# EAGLE schematic opengarden_v1 (EAGLE 6.1)
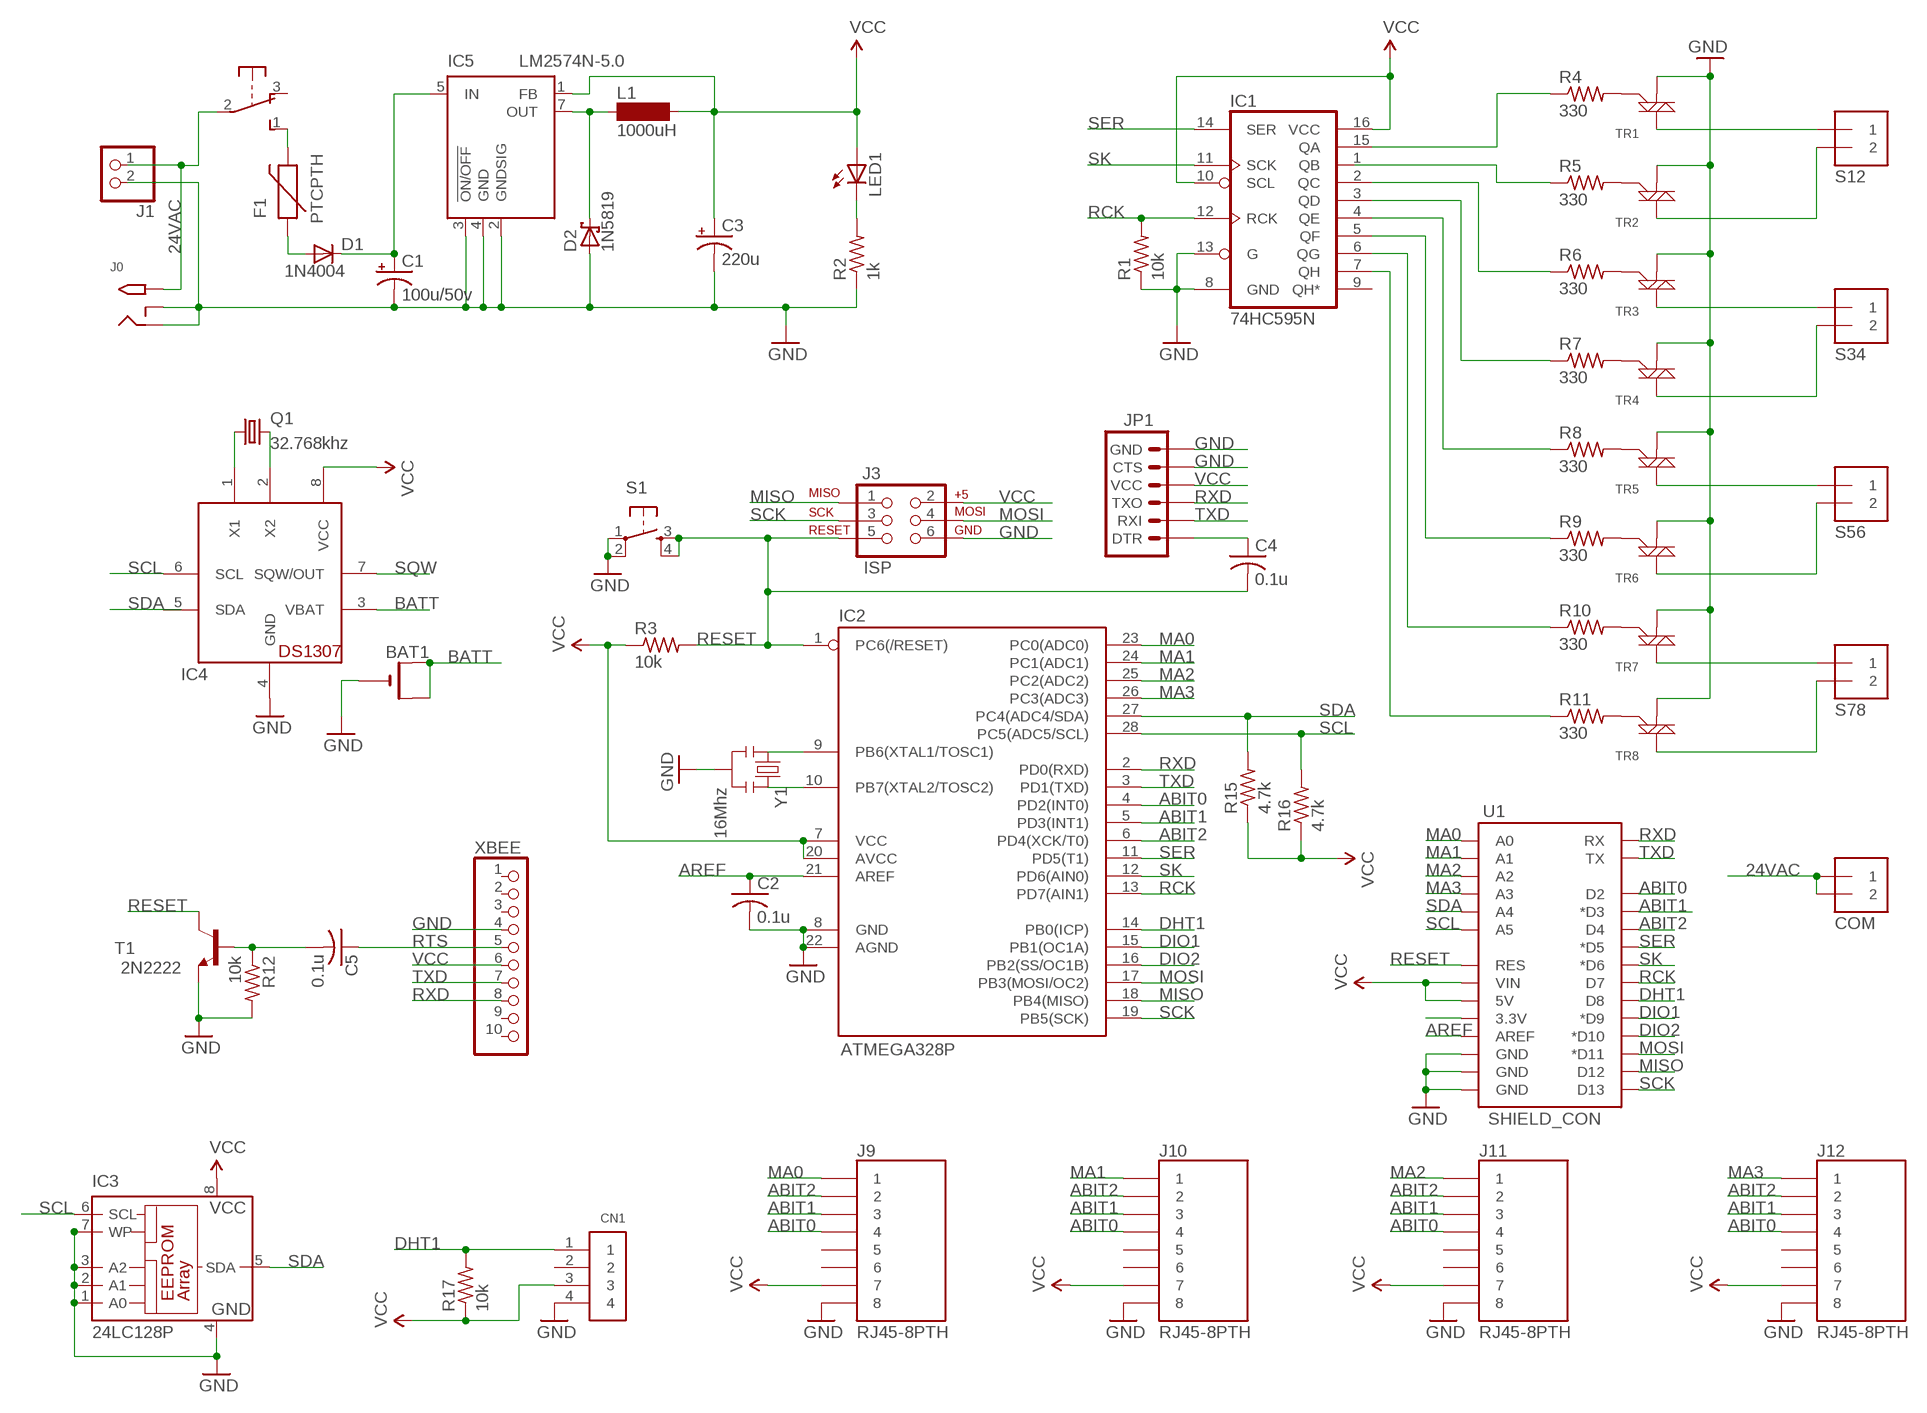
[diagram p0: schematic, sheet 1]

## Parts
BAT1  CR1220THM  [CR1220-THM]
C1  100u/50v  CPOL-USE3.5-8  [E3,5-8]
C2  0.1u  C-US025-024X044  [C025-024X044]
C3  220u  CPOL-USE2,5-6E  [E2,5-6E]
C4  0.1u  C-US025-024X044  [C025-024X044]
C5  0.1u  C-US025-024X044  [C025-024X044]
CN1  1X4-3.5MM  [1X04-3.5MM]
COM  1X2-3.5MM  [1X2-3.5MM]
D1  1N4004  [DO41-10]
D2  1N5819  SCHOTTKY-DIODEDO41  [DO41-10]
F1  PTCPTH  [PTC]
IC1  74HC595N  74LS595N  [DIL16]
IC2  ATMEGA328P  AVR-MEGA8-PPTH  [DIL28-3]
IC3  24LC128P  [DIL8]
IC4  DS1307  [DIL08]
IC5  LM2574N-5.0  [DIL08]
J0  2.1MMJACKTHM  [PJ-102A]
J1  JST_2PIN-THM  [JST-PH-2-THM]
J2  OS102011MA1Q  [OS102011MA1Q]
J3  ISP  AVR_SPI_PRG_6PTH  [2X3]
J9  RJ45-8PTH  [RJ45-8]
J10  RJ45-8PTH  [RJ45-8]
J11  RJ45-8PTH  [RJ45-8]
J12  RJ45-8PTH  [RJ45-8]
JP1  ARDUINO_SERIAL_PROGRAMLOCK  [1X06_LOCK]
L1  1000uH  BS11  [BS11]
LED1  LED3MM  [LED3MM]
Q1  32.768khz  CRYSTALTC26V  [TC26V]
R1  10k  R-US_0204/7  [0204/7]
R2  1k  R-US_0204/7  [0204/7]
R3  10k  R-US_0204/7  [0204/7]
R4  330  R-US_0204/7  [0204/7]
R5  330  R-US_0204/7  [0204/7]
R6  330  R-US_0204/7  [0204/7]
R7  330  R-US_0204/7  [0204/7]
R8  330  R-US_0204/7  [0204/7]
R9  330  R-US_0204/7  [0204/7]
R10  330  R-US_0204/7  [0204/7]
R11  330  R-US_0204/7  [0204/7]
R12  10k  R-US_0204/7  [0204/7]
R15  4.7k  R-US_0204/7  [0204/7]
R16  4.7k  R-US_0204/7  [0204/7]
R17  10k  R-US_0204/7  [0204/7]
S1  TAC_SWITCHPTH  [TACTILE-PTH]
S12  1X2-3.5MM  [1X2-3.5MM]
S34  1X2-3.5MM  [1X2-3.5MM]
S56  1X2-3.5MM  [1X2-3.5MM]
S78  1X2-3.5MM  [1X2-3.5MM]
T1  2N2222  [TO92-EBC-OVAL]
TR1  TRIACPTH  [TO-92]
TR2  TRIACPTH  [TO-92]
TR3  TRIACPTH  [TO-92]
TR4  TRIACPTH  [TO-92]
TR5  TRIACPTH  [TO-92]
TR6  TRIACPTH  [TO-92]
TR7  TRIACPTH  [TO-92]
TR8  TRIACPTH  [TO-92]
U1  SHIELD_CON  ARDUINO_SHIELDNO_SILK  [DUEMILANOVE_VIAS]
XBEE  XBEE  PINHD-1X10  [1X10-BIG]
Y1  16Mhz  RESONATORPTH  [RESONATOR-PTH]

## Nets
24VAC: COM.1 COM.2 J0.TIP J1.1 J2.2(P)
ABIT0: IC2.4(PD2(INT0)) J9.4 J10.4 J11.4 J12.4 U1.D2
ABIT1: IC2.5(PD3(INT1)) J9.3 J10.3 J11.3 J12.3 U1.D3(*D3)
ABIT2: IC2.6(PD4(XCK/T0)) J9.2 J10.2 J11.2 J12.2 U1.D4
AREF: C2.1 IC2.21(AREF) U1.AREF
BATT: BAT1.+1(+) BAT1.+2(+1) IC4.3(VBAT)
DHT1: CN1.1 IC2.14(PB0(ICP)) R17.2 U1.D8
DIO1: IC2.15(PB1(OC1A)) U1.D9(*D9)
DIO2: IC2.16(PB2(SS/OC1B)) U1.D10(*D10)
GND: BAT1.- C1.- C2.2 C3.- CN1.4 D2.A IC1.8(GND) IC1.13(G) IC2.8(GND) IC2.22(AGND) IC3.1(A0) IC3.2(A1) IC3.3(A2) IC3.4(GND) IC3.7(WP) IC4.4(GND) IC5.2(GNDSIG) IC5.3(!ON/OFF) IC5.4(GND) J0.RING J0.RING_SW J1.2 J3.6 J9.8 J10.8 J11.8 J12.8 JP1.5(CTS) JP1.6(GND) R1.1 R2.1 R12.2 S1.1 S1.2 T1.E TR1.1(M1) TR2.1(M1) TR3.1(M1) TR4.1(M1) TR5.1(M1) TR6.1(M1) TR7.1(M1) TR8.1(M1) U1.GND@0(GND) U1.GND@1(GND) U1.GND@2(GND) XBEE.4 Y1.2
MA0: IC2.23(PC0(ADC0)) J9.1 U1.A0
MA1: IC2.24(PC1(ADC1)) J10.1 U1.A1
MA2: IC2.25(PC2(ADC2)) J11.1 U1.A2
MA3: IC2.26(PC3(ADC3)) J12.1 U1.A3
MISO: IC2.18(PB4(MISO)) J3.1 U1.D12
MOSI: IC2.17(PB3(MOSI/OC2)) J3.4 U1.D11(*D11)
N$1: IC4.1(X1) Q1.1
N$2: IC4.2(X2) Q1.2
N$3: IC2.10(PB7(XTAL2/TOSC2)) Y1.3
N$4: IC2.9(PB6(XTAL1/TOSC1)) Y1.1
N$5: LED1.K(C) R2.2
N$6: C5.2 R12.1 T1.B
N$7: C4.1 JP1.1(DTR)
N$8: F1.P$2 J2.1(S)
N$9: D1.A F1.P$1
N$10: C1.+ D1.C IC5.5(IN)
N$11: D2.C IC5.7(OUT) L1.1
N$12: R4.2 TR1.2(G)
N$13: R5.2 TR2.2(G)
N$14: R6.2 TR3.2(G)
N$15: R7.2 TR4.2(G)
N$16: R8.2 TR5.2(G)
N$17: R9.2 TR6.2(G)
N$18: R10.2 TR7.2(G)
N$19: R11.2 TR8.2(G)
N$20: IC1.15(QA) R4.1
N$21: IC1.1(QB) R5.1
N$22: IC1.2(QC) R6.1
N$23: IC1.3(QD) R7.1
N$24: IC1.4(QE) R8.1
N$25: IC1.5(QF) R9.1
N$26: IC1.6(QG) R10.1
N$27: IC1.7(QH) R11.1
N$29: S12.1 TR1.3(M2)
N$30: S34.1 TR3.3(M2)
N$31: S56.1 TR5.3(M2)
N$32: S78.1 TR7.3(M2)
N$33: S78.2 TR8.3(M2)
N$34: S56.2 TR6.3(M2)
N$35: S34.2 TR4.3(M2)
N$36: S12.2 TR2.3(M2)
N$51: U1.3.3V
RCK: IC1.12(RCK) IC2.13(PD7(AIN1)) R1.2 U1.D7
RESET: C4.2 IC2.1(PC6(/RESET)) J3.5 R3.2 S1.3 S1.4 T1.C U1.RES
RTS: C5.1 XBEE.5
RXD: IC2.2(PD0(RXD)) JP1.3(TXO) U1.RX XBEE.8
SCK: IC2.19(PB5(SCK)) J3.3 U1.D13
SCL: IC2.28(PC5(ADC5/SCL)) IC3.6(SCL) IC4.6(SCL) R16.2 U1.A5
SDA: IC2.27(PC4(ADC4/SDA)) IC3.5(SDA) IC4.5(SDA) R15.2 U1.A4
SER: IC1.14(SER) IC2.11(PD5(T1)) U1.D5(*D5)
SK: IC1.11(SCK) IC2.12(PD6(AIN0)) U1.D6(*D6)
SQW: IC4.7(SQW/OUT)
TXD: IC2.3(PD1(TXD)) JP1.2(RXI) U1.TX XBEE.7
VCC: C3.+ CN1.3 IC1.10(SCL) IC1.16(VCC) IC2.7(VCC) IC2.20(AVCC) IC3.8(VCC) IC4.8(VCC) IC5.1(FB) J3.2 J9.7 J10.7 J11.7 J12.7 JP1.4(VCC) L1.2 LED1.A R3.1 R15.1 R16.1 R17.1 U1.5V U1.VIN XBEE.6
Unconnected: CN1.2 IC1.9(QH*) J2.3(O) J2.MT1(MT) J2.MT2(MT) J9.5 J9.6 J10.5 J10.6 J11.5 J11.6 J12.5 J12.6 XBEE.1 XBEE.2 XBEE.3 XBEE.9 XBEE.10

## Notes on the sheet
- S12
- S34
- S56
- S78
- COM

## Library data of the parts
BAT1 = adafruit:CR1220: CR1216/CR1220/CR1225 12mm 3V lithium coin cell Great for battery packup. Both SMT and THM holders. Note the THM package has the ground pads on both sides of the PCB so that the masks are the same - this reduces the cost
C1 C3 = adafruit:CPOL-US: POLARIZED CAPACITOR, American symbol
C2 C4 C5 = adafruit:C-US: CAPACITOR, American symbol
CN1 = adafruit:1X4: 4-pin connector
COM S12 S34 S56 S78 = adafruit:1X2: 3.5mm Terminal block http://www.ladyada.net/library/pcb/eaglelibrary.html
D1 = adafruit:1N4004: DIODE General purpose 1N400x type rectifier (With bigger pads) http://www.ladyada.net/library/pcb/eaglelibrary.html
D2 = adafruit:SCHOTTKY-DIODE: Schottky Diode
F1 = SparkFun-PowerIC:PTC: Resettable Fuse PTC Resettable Fuse. Spark Fun Electronics SKU : COM-08357
IC1 = SparkFun-DigitalIC:74*595: 8-bit SHIFT REGISTER, output latch
IC2 = SparkFun-DigitalIC:AVR-MEGA8-P: MICROCONTROLLER 8 Kbytes FLASH 1 kbytes SRAM 512 bytes EEPROM USART 4-channel 10 bit ADC 2-channel 8 bit ADC
IC3 = microchip:24*: Serial EEPROM I2C; MF: MICROCHIP; MPN: 24LC128-I/P; OC_FARNELL: 9757929; OC_NEWARK: 12C2007
IC4 = adafruit:DS1307: DS1307 Real time clock (RTC) with battery backup ability. Talk to it via i2c
IC5 = linear:LM2574?-*: SIMPLE SWITCHER 0.5A Step-Down Voltage Regulator Source: http://cache.national.com/ds/LM/LM2574.pdf
J0 = adafruit:2.1MMJACK: 2.1mm x 5.5mm THM DC jack with internal switch. Digikey part #PJ-102A, 4UCON part #05537 2.1mm x 5.5mm SMT DC jack with internal switch. Digikey part #PJ-002A-SMT, 4UCON part #03267 By microbuilder.eu & adafruit.com
J1 = adafruit:JST_2PIN: JST 2-Pin Connectors of various flavors SMT-RA (S2B-PH-SM4) 4UConnector #17311 SMT (B2B-PH-SM4) THM-RA (S2B-PH) THM (B2B-PH)
J2 = adafruit:OS102011MA1Q: OS10201MA1Q through-hole right angle switch http://www.ladyada.net/library/eagle
J3 = SparkFun-Connectors:AVR_SPI_PRG_6: AVR ISP 6 Pin This is the reduced ISP connector for AVR programming. Common on Arduino. This footprint will take up less PCB space and can be used with a 10-pin to 6-pin adapter such as SKU: BOB-08508
J9-J12 = SparkFun-Connectors:RJ45-8: RJ45 Jack Simple RJ45, 8-pin connection - connector for common Cat5, Cat5e, and Cat6 Ethernet cables. Footprint not yet proven in production. Connector sku is PRT-00643; Breakout PCB sku is BOB-00716.
JP1 = SparkFun-Connectors:ARDUINO_SERIAL_PROGRAM: FTDI connector footprints
L1 = inductor-neosid:BS: INDUCTOR nominal inductance, magnetically screened; OC_FARNELL: unknown; OC_NEWARK: unknown
LED1 = adafruit:LED: LED OSRAM: - CHIPLED LG R971, LG N971, LY N971, LG Q971, LY Q971, LO R971, LY R971 LH N974, LH R974 LS Q976, LO Q976, LY Q976 LO Q996 - Hyper CHIPLED LW Q18S LB Q993, LB Q99A, LB R99A - SideLED LS A670, LO A670, LY A670, LG A670, LP A670 LB A673, LV A673, LT A673, LW A673 LH A674 LY A675 LS A676, LA A676, LO A676, LY A676, LW A676 LS A679, LY A679, LG A679 - Hyper Micro SIDELED® LS Y876, LA Y876, LO Y876, LY Y876 LT Y87S - SmartLED LW L88C, LW L88S LB L89C, LB L89S, LG L890 LS L89K, LO L89K, LY L89K LS L896, LA L896, LO L896, LY L896 - TOPLED LS T670, LO T670, LY T670, LG T670, LP T670 LSG T670, LSP T670, LSY T670, LOP T670, LYG T670 LG T671, LOG T671, LSG T671 LB T673, LV T673, LT T673, LW T673 LH T674 LS T676, LA T676, LO T676, LY T676, LB T676, LH T676, LSB T676, LW T676 LB T67C, LV T67C, LT T67C, LS T67K, LO T67K, LY T67K, LW E67C LS E67B, LA E67B, LO E67B, LY E67B, LB E67C, LV E67C, LT E67C LW T67C LS T679, LY T679, LG T679 LS T770, LO T770, LY T770, LG T770, LP T770 LB T773, LV T773, LT T773, LW T773 LH T774 LS E675, LA E675, LY E675, LS T675 LS T776, LA T776, LO T776, LY T776, LB T776 LHGB T686 LT T68C, LB T68C - Hyper Mini TOPLED® LB M676 - Mini TOPLED Santana® LG M470 LS M47K, LO M47K, LY M47K Source: http://www.osram.convergy.de/
Q1 = crystal:CRYSTAL: CRYSTAL; OC_FARNELL: unknown; OC_NEWARK: unknown
R1-R12 R15-R17 = adafruit:R-US_: RESISTOR, American symbol
S1 = SparkFun-Electromechanical:TAC_SWITCH: Momentary Switch Button commonly used for reset or general input. Spark Fun Electronics SKU : COM-00097
T1 = adafruit:2N2222: NPN TRANSISTOR Big oval pads
TR1-TR8 = SparkFun-DiscreteSemi:TRIAC: Low-power generic TRIAC packages
U1 = SparkFun-Boards:ARDUINO_SHIELD: Arduino shield footprint
XBEE = adafruit:PINHD-1X10: Pin header 1x10 0.1" spacing With round pins
Y1 = SparkFun-FreqCtrl:RESONATOR: Resonator Small SMD resonator. This is the itty bitty 10/20MHz resonators with built in caps. CSTCE10M0G55 and CSTCE20M0V53. Footprint has been reviewed closely but hasn't been tested yet.